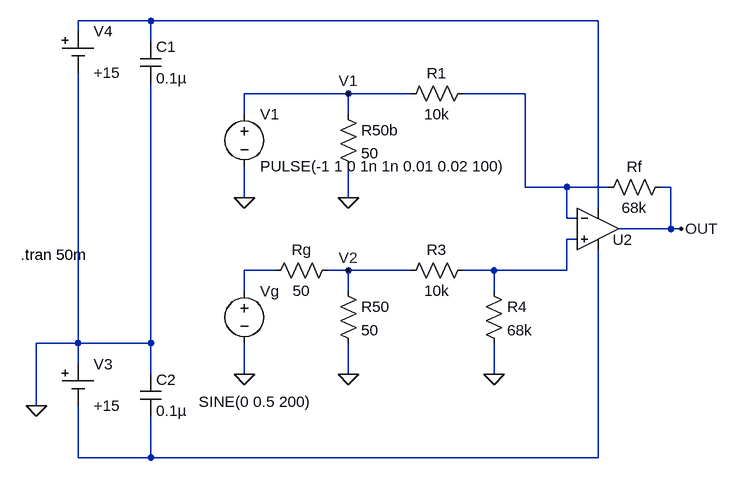
[diagram p0: schematic Circuito4.asc]
Circuito4.asc, the LTspice schematic file:
Version 4
SHEET 1 880 680
WIRE -160 -16 -272 -16
WIRE 528 -16 -160 -16
WIRE -272 0 -272 -16
WIRE -160 16 -160 -16
WIRE 144 96 -16 96
WIRE 240 96 144 96
WIRE 416 96 320 96
WIRE -16 128 -16 96
WIRE 144 128 144 96
WIRE 416 240 416 96
WIRE 480 240 416 240
WIRE 544 240 480 240
WIRE 640 240 624 240
WIRE -16 256 -16 208
WIRE 144 256 144 208
WIRE 528 272 528 -16
WIRE 480 288 480 240
WIRE 496 288 480 288
WIRE 640 304 640 240
WIRE 640 304 560 304
WIRE 656 304 640 304
WIRE 496 320 480 320
WIRE 32 368 -16 368
WIRE 144 368 112 368
WIRE 240 368 144 368
WIRE 368 368 320 368
WIRE 480 368 480 320
WIRE 480 368 368 368
WIRE -16 400 -16 368
WIRE 144 400 144 368
WIRE 368 400 368 368
WIRE -272 480 -272 64
WIRE -272 480 -336 480
WIRE -160 480 -160 80
WIRE -160 480 -272 480
WIRE -272 512 -272 480
WIRE -160 528 -160 480
WIRE -16 528 -16 480
WIRE 144 528 144 480
WIRE 368 528 368 480
WIRE -336 576 -336 480
WIRE -272 656 -272 576
WIRE -160 656 -160 592
WIRE -160 656 -272 656
WIRE 528 656 528 336
WIRE 528 656 -160 656
FLAG -16 256 0
FLAG 144 256 0
FLAG -336 576 0
FLAG 144 96 V1
FLAG 656 304 OUT
FLAG -16 528 0
FLAG 144 528 0
FLAG 144 368 V2
FLAG 368 528 0
SYMBOL cap -176 528 R0
SYMATTR InstName C2
SYMATTR Value 0.1µ
SYMBOL Misc\\cell -272 512 R0
WINDOW 123 0 0 Left 0
WINDOW 39 0 0 Left 0
SYMATTR InstName V3
SYMATTR Value +15
SYMBOL Misc\\cell -272 0 R0
WINDOW 123 0 0 Left 0
WINDOW 39 0 0 Left 0
SYMATTR InstName V4
SYMATTR Value +15
SYMBOL res 224 112 R270
WINDOW 0 32 56 VTop 2
WINDOW 3 0 56 VBottom 2
SYMATTR InstName R1
SYMATTR Value 10k
SYMBOL res 640 224 R90
WINDOW 0 0 56 VBottom 2
WINDOW 3 32 56 VTop 2
SYMATTR InstName Rf
SYMATTR Value 68k
SYMBOL res 128 112 R0
SYMATTR InstName R50b
SYMATTR Value 50
SYMBOL cap -176 16 R0
SYMATTR InstName C1
SYMATTR Value 0.1µ
SYMBOL Opamps/UniversalOpamp2 528 304 R0
WINDOW 0 23 17 Left 2
SYMATTR InstName U2
SYMBOL res 128 352 R90
WINDOW 0 0 56 VBottom 2
WINDOW 3 32 56 VTop 2
SYMATTR InstName Rg
SYMATTR Value 50
SYMBOL res 224 384 R270
WINDOW 0 32 56 VTop 2
WINDOW 3 0 56 VBottom 2
SYMATTR InstName R3
SYMATTR Value 10k
SYMBOL voltage -16 384 R0
WINDOW 3 -70 186 Left 2
WINDOW 123 0 0 Left 0
WINDOW 39 0 0 Left 0
SYMATTR Value SINE(0 0.5 200)
SYMATTR InstName Vg
SYMBOL res 128 384 R0
SYMATTR InstName R50
SYMATTR Value 50
SYMBOL res 352 384 R0
SYMATTR InstName R4
SYMATTR Value 68k
SYMBOL voltage -16 112 R0
WINDOW 123 0 0 Left 0
WINDOW 39 0 0 Left 0
SYMATTR InstName V1
SYMATTR Value PULSE(-1 1 0 1n 1n 0.01 0.02 100)
TEXT -360 344 Left 2 !.tran 50m

The netlist it stands for:
* Circuito4.asc
C2 0 N005 0.1µ
V3 0 N005 +15
V4 N001 0 +15
R1 V1 N002 10k
Rf OUT N002 68k
R50b V1 0 50
C1 N001 0 0.1µ
XU2 N003 N002 N001 N005 OUT level.2 Avol=1Meg GBW=10Meg Slew=10Meg ilimit=25m rail=0 Vos=0 phimargin=45 en=0 enk=0 in=0 ink=0 Rin=500Meg  ; pins IN+ IN- V+ V- OUT
Rg V2 N004 50
R3 V2 N003 10k
Vg N004 0 SINE(0 0.5 200)
R50 V2 0 50
R4 N003 0 68k
V1 V1 0 PULSE(-1 1 0 1n 1n 0.01 0.02 100)
.tran 50m
.lib UniversalOpamps2.sub
.backanno
.end